# EAGLE schematic L3GD20 (EAGLE 7.1.0)
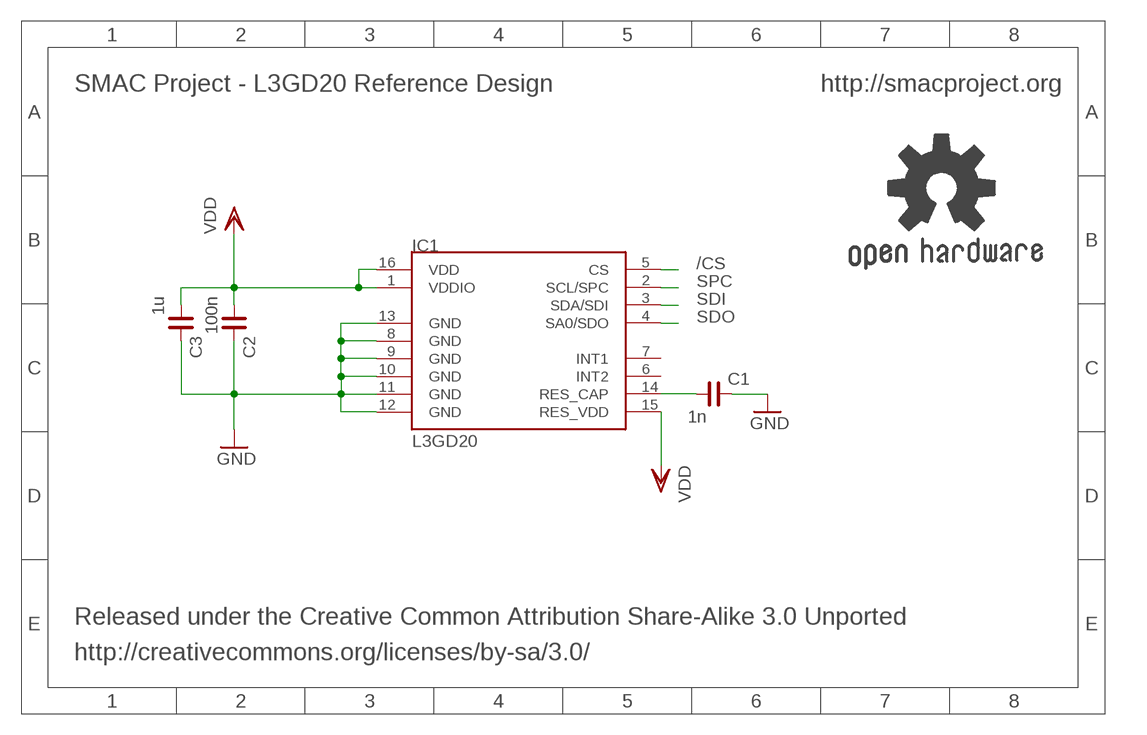
[diagram p0: schematic, sheet 1]

## Parts
C1  1n  C_0402  [C0402]
C2  100n  C_0402  [C0402]
C3  1u  C_0402  [C0402]
GOLD_ORB_SM2  OSHWLOGO_REF_SM  [OSHW2REF]
IC1  L3GD20  [LGA16-4X4]

## Nets
/CS: IC1.5(CS)
GND: C1.2 C2.2 C3.2 IC1.8(GND) IC1.9(GND) IC1.10(GND) IC1.12(GND) IC1.13(GND)
N$4: C1.1 IC1.14(RES_CAP)
SDI: IC1.3(SDA/SDI)
SDO: IC1.4(SA0/SDO)
SPC: IC1.2(SCL/SPC)
VDD: C2.1 C3.1 IC1.1(VDDIO) IC1.15(RES_VDD) IC1.16(VDD)
Unconnected: IC1.6(INT2) IC1.7(INT1) IC1.11(GND)

## Notes on the sheet
- SMAC Project - L3GD20 Reference Design | http://smacproject.org
- Released under the Creative Common Attribution Share-Alike 3.0 Unported
- http://creativecommons.org/licenses/by-sa/3.0/

## Library data of the parts
C1-C3 = rc-master-smd:C_: NON-POLARIZED CAP
GOLD_ORB_SM2 = bfl:OSHWLOGO: These are Open-Source Hardware logos.
IC1 = SparkFun-Sensors:L3GD20